# Altium schematic sheet HeaderC.SchDoc: 02290_Sonoma_Controller
size B; ApprovedBy: J Johnson; CheckedBy: J Johnson; Author: sdfasdfdfAEFfasdFfaF; DrawnBy: J Johnson; Organization: Opsero Electronic Design; Address1: 21-915 Av. Marguerite-Bourgeoys; Address2: Québec (QC); Address3: G1S 3X4; DocumentNumber: OP009-001-SCH; Revision: B-1; SheetNumber: 11; SheetTotal: 16; Tel1: (581) 308-8830; Tel2: (581) 308-8830; Project: 02290_Sonoma_Controller; CheckedDate: yyyy-mm-dd; Sheet: Header C; PageSetup: Record=PageOptions|CenterHorizontal=True|CenterVertical=True|PrintScale=1.08|XCorrection=1.00|YCorrection=1.00|PrintKind=0|BorderSize=5000000|LeftOffset=0|BottomOffset=0|Orientation=2|PaperLength=1000|PaperWidth=1000|Scale=100|PaperSource=7|PrintQuality=-4|MediaType=1|DitherType=10|PaperKind=Tabloid     [11 x 17 in]|PrintScaleMode=1; DrawDate: 2013-12-13; SchTitle: 02290_Sonoma_Controller; RevDescription: Removed QSPI, JP4/5, temp mon, JP6, U31; RevDate: 2019-05-24; RevBy: J Johnson; RevDescription2: Replaced D1 with RB521S30, J2 with L834-1G1T-S7; RevDescription3: Replaced FETs with TSM900N06CW RPG
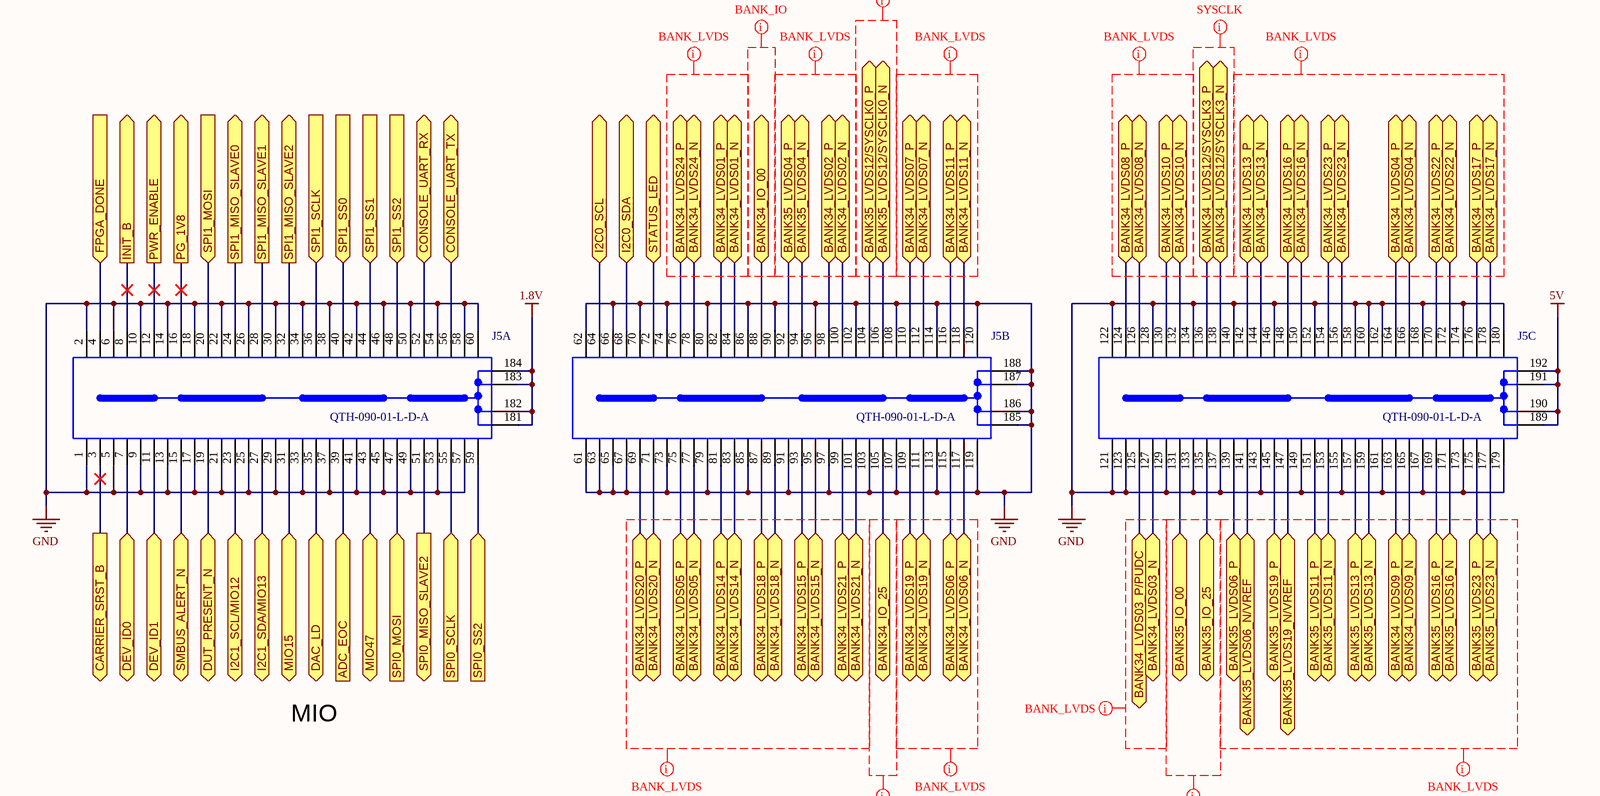
[diagram p0: HeaderC.SchDoc]

## Parts
J5  QTH-090-01-L-D-A  [QTH-090-01-L-D-A]  (parts A,B,C of 3)

## Ports
ADC_EOC (in), BANK34_IO_00 (bidir), BANK34_IO_25 (bidir), BANK34_LVDS01_N (bidir), BANK34_LVDS01_P (bidir), BANK34_LVDS02_N (bidir), BANK34_LVDS02_P (bidir), BANK34_LVDS03_N (bidir), BANK34_LVDS03_P/PUDC (bidir), BANK34_LVDS04_N (bidir), BANK34_LVDS04_P (bidir), BANK34_LVDS05_N (bidir), BANK34_LVDS05_P (bidir), BANK34_LVDS06_N (bidir), BANK34_LVDS06_P (bidir), BANK34_LVDS07_N (bidir), BANK34_LVDS07_P (bidir), BANK34_LVDS08_N (bidir), BANK34_LVDS08_P (bidir), BANK34_LVDS09_N (bidir), BANK34_LVDS09_P (bidir), BANK34_LVDS10_N (bidir), BANK34_LVDS10_P (bidir), BANK34_LVDS11_N (bidir), BANK34_LVDS11_P (bidir), BANK34_LVDS12/SYSCLK3_N (bidir), BANK34_LVDS12/SYSCLK3_P (bidir), BANK34_LVDS13_N (bidir), BANK34_LVDS13_P (bidir), BANK34_LVDS14_N (bidir), BANK34_LVDS14_P (bidir), BANK34_LVDS15_N (bidir), BANK34_LVDS15_P (bidir), BANK34_LVDS16_N (bidir), BANK34_LVDS16_P (bidir), BANK34_LVDS17_N (bidir), BANK34_LVDS17_P (bidir), BANK34_LVDS18_N (bidir), BANK34_LVDS18_P (bidir), BANK34_LVDS19_N (bidir), BANK34_LVDS19_P (bidir), BANK34_LVDS20_N (bidir), BANK34_LVDS20_P (bidir), BANK34_LVDS21_N (bidir), BANK34_LVDS21_P (bidir), BANK34_LVDS22_N (bidir), BANK34_LVDS22_P (bidir), BANK34_LVDS23_N (bidir), BANK34_LVDS23_P (bidir), BANK34_LVDS24_N (bidir), BANK34_LVDS24_P (bidir), BANK35_IO_00 (bidir), BANK35_IO_25 (bidir), BANK35_LVDS04_N (bidir), BANK35_LVDS04_P (bidir), BANK35_LVDS06_N/VREF (bidir), BANK35_LVDS06_P (bidir), BANK35_LVDS11_N (bidir), BANK35_LVDS11_P (bidir), BANK35_LVDS12/SYSCLK0_N (bidir), BANK35_LVDS12/SYSCLK0_P (bidir), BANK35_LVDS13_N (bidir), BANK35_LVDS13_P (bidir), BANK35_LVDS16_N (bidir), BANK35_LVDS16_P (bidir), BANK35_LVDS19_N/VREF (bidir), BANK35_LVDS19_P (bidir), BANK35_LVDS23_N (bidir), BANK35_LVDS23_P (bidir), CARRIER_SRST_B (out), CONSOLE_UART_RX (bidir), CONSOLE_UART_TX (bidir), DAC_LD (bidir), DEV_ID0 (bidir), DEV_ID1 (bidir), DUT_PRESENT_N (bidir), FPGA_DONE (in), I2C0_SCL (bidir), I2C0_SDA (bidir), I2C1_SCL/MIO12 (bidir), I2C1_SDA/MIO13 (bidir), INIT_B (out), MIO15 (bidir), MIO47 (bidir), PG_1V8 (out), PWR_ENABLE (out), SMBUS_ALERT_N (bidir), SPI0_MISO_SLAVE2 (out), SPI0_MOSI (in), SPI0_SCLK (in), SPI0_SS2 (in), SPI1_MISO_SLAVE0 (out), SPI1_MISO_SLAVE1 (out), SPI1_MISO_SLAVE2 (out), SPI1_MOSI (in), SPI1_SCLK (in), SPI1_SS0 (in), SPI1_SS1 (in), SPI1_SS2 (in), STATUS_LED (bidir)

## Nets
1.8V: J5.181 J5.182 J5.183 J5.184
5V: J5.189 J5.190 J5.191 J5.192
GND: J5.1 J5.2 J5.5 J5.6 J5.9 J5.10 J5.13 J5.14 J5.17 J5.18 J5.21 J5.22 J5.25 J5.26 J5.29 J5.30 J5.33 J5.34 J5.37 J5.38 J5.41 J5.42 J5.45 J5.46 J5.49 J5.50 J5.53 J5.54 J5.57 J5.58 J5.60 J5.61 J5.62 J5.63 J5.65 J5.66 J5.67 J5.70 J5.73 J5.74 J5.79 J5.80 J5.85 J5.86 J5.90 J5.91 J5.96 J5.97 J5.102 J5.103 J5.107 J5.108 J5.113 J5.114 J5.119 J5.120 J5.121 J5.122 J5.123 J5.128 J5.129 J5.133 J5.134 J5.137 J5.140 J5.143 J5.146 J5.149 J5.152 J5.155 J5.158 J5.160 J5.161 J5.162 J5.167 J5.168 J5.173 J5.174 J5.179 J5.180 J5.185 J5.186 J5.187 J5.188
ADC_EOC: J5.39 ; port ADC_EOC
BANK34_IO_00: J5.88 ; port BANK34_IO_00
BANK34_IO_25: J5.105 ; port BANK34_IO_25
BANK34_LVDS01_N: J5.84 ; port BANK34_LVDS01_N
BANK34_LVDS01_P: J5.82 ; port BANK34_LVDS01_P
BANK34_LVDS02_N: J5.100 ; port BANK34_LVDS02_N
BANK34_LVDS02_P: J5.98 ; port BANK34_LVDS02_P
BANK34_LVDS03_N: J5.127 ; port BANK34_LVDS03_N
BANK34_LVDS03_P/PUDC: J5.125 ; port BANK34_LVDS03_P/PUDC
BANK34_LVDS04_N: J5.166 ; port BANK34_LVDS04_N
BANK34_LVDS04_P: J5.164 ; port BANK34_LVDS04_P
BANK34_LVDS05_N: J5.77 ; port BANK34_LVDS05_N
BANK34_LVDS05_P: J5.75 ; port BANK34_LVDS05_P
BANK34_LVDS06_N: J5.117 ; port BANK34_LVDS06_N
BANK34_LVDS06_P: J5.115 ; port BANK34_LVDS06_P
BANK34_LVDS07_N: J5.112 ; port BANK34_LVDS07_N
BANK34_LVDS07_P: J5.110 ; port BANK34_LVDS07_P
BANK34_LVDS08_N: J5.126 ; port BANK34_LVDS08_N
BANK34_LVDS08_P: J5.124 ; port BANK34_LVDS08_P
BANK34_LVDS09_N: J5.165 ; port BANK34_LVDS09_N
BANK34_LVDS09_P: J5.163 ; port BANK34_LVDS09_P
BANK34_LVDS10_N: J5.132 ; port BANK34_LVDS10_N
BANK34_LVDS10_P: J5.130 ; port BANK34_LVDS10_P
BANK34_LVDS11_N: J5.118 ; port BANK34_LVDS11_N
BANK34_LVDS11_P: J5.116 ; port BANK34_LVDS11_P
BANK34_LVDS12/SYSCLK3_N: J5.138 ; port BANK34_LVDS12/SYSCLK3_N
BANK34_LVDS12/SYSCLK3_P: J5.136 ; port BANK34_LVDS12/SYSCLK3_P
BANK34_LVDS13_N: J5.144 ; port BANK34_LVDS13_N
BANK34_LVDS13_P: J5.142 ; port BANK34_LVDS13_P
BANK34_LVDS14_N: J5.83 ; port BANK34_LVDS14_N
BANK34_LVDS14_P: J5.81 ; port BANK34_LVDS14_P
BANK34_LVDS15_N: J5.95 ; port BANK34_LVDS15_N
BANK34_LVDS15_P: J5.93 ; port BANK34_LVDS15_P
BANK34_LVDS16_N: J5.150 ; port BANK34_LVDS16_N
BANK34_LVDS16_P: J5.148 ; port BANK34_LVDS16_P
BANK34_LVDS17_N: J5.178 ; port BANK34_LVDS17_N
BANK34_LVDS17_P: J5.176 ; port BANK34_LVDS17_P
BANK34_LVDS18_N: J5.89 ; port BANK34_LVDS18_N
BANK34_LVDS18_P: J5.87 ; port BANK34_LVDS18_P
BANK34_LVDS19_N: J5.111 ; port BANK34_LVDS19_N
BANK34_LVDS19_P: J5.109 ; port BANK34_LVDS19_P
BANK34_LVDS20_N: J5.71 ; port BANK34_LVDS20_N
BANK34_LVDS20_P: J5.69 ; port BANK34_LVDS20_P
BANK34_LVDS21_N: J5.101 ; port BANK34_LVDS21_N
BANK34_LVDS21_P: J5.99 ; port BANK34_LVDS21_P
BANK34_LVDS22_N: J5.172 ; port BANK34_LVDS22_N
BANK34_LVDS22_P: J5.170 ; port BANK34_LVDS22_P
BANK34_LVDS23_N: J5.156 ; port BANK34_LVDS23_N
BANK34_LVDS23_P: J5.154 ; port BANK34_LVDS23_P
BANK34_LVDS24_N: J5.78 ; port BANK34_LVDS24_N
BANK34_LVDS24_P: J5.76 ; port BANK34_LVDS24_P
BANK35_IO_00: J5.131 ; port BANK35_IO_00
BANK35_IO_25: J5.135 ; port BANK35_IO_25
BANK35_LVDS04_N: J5.94 ; port BANK35_LVDS04_N
BANK35_LVDS04_P: J5.92 ; port BANK35_LVDS04_P
BANK35_LVDS06_N/VREF: J5.141 ; port BANK35_LVDS06_N/VREF
BANK35_LVDS06_P: J5.139 ; port BANK35_LVDS06_P
BANK35_LVDS11_N: J5.153 ; port BANK35_LVDS11_N
BANK35_LVDS11_P: J5.151 ; port BANK35_LVDS11_P
BANK35_LVDS12/SYSCLK0_N: J5.106 ; port BANK35_LVDS12/SYSCLK0_N
BANK35_LVDS12/SYSCLK0_P: J5.104 ; port BANK35_LVDS12/SYSCLK0_P
BANK35_LVDS13_N: J5.159 ; port BANK35_LVDS13_N
BANK35_LVDS13_P: J5.157 ; port BANK35_LVDS13_P
BANK35_LVDS16_N: J5.171 ; port BANK35_LVDS16_N
BANK35_LVDS16_P: J5.169 ; port BANK35_LVDS16_P
BANK35_LVDS19_N/VREF: J5.147 ; port BANK35_LVDS19_N/VREF
BANK35_LVDS19_P: J5.145 ; port BANK35_LVDS19_P
BANK35_LVDS23_N: J5.177 ; port BANK35_LVDS23_N
BANK35_LVDS23_P: J5.175 ; port BANK35_LVDS23_P
CARRIER_SRST_B: J5.3 ; port CARRIER_SRST_B
CONSOLE_UART_RX: J5.52 ; port CONSOLE_UART_RX
CONSOLE_UART_TX: J5.56 ; port CONSOLE_UART_TX
DAC_LD: J5.35 ; port DAC_LD
DEV_ID0: J5.7 ; port DEV_ID0
DEV_ID1: J5.11 ; port DEV_ID1
DUT_PRESENT_N: J5.19 ; port DUT_PRESENT_N
FPGA_DONE: J5.4 ; port FPGA_DONE
I2C0_SCL: J5.64 ; port I2C0_SCL
I2C0_SDA: J5.68 ; port I2C0_SDA
I2C1_SCL/MIO12: J5.23 ; port I2C1_SCL/MIO12
I2C1_SDA/MIO13: J5.27 ; port I2C1_SDA/MIO13
INIT_B: J5.8 ; port INIT_B
MIO15: J5.31 ; port MIO15
MIO47: J5.43 ; port MIO47
PG_1V8: J5.16 ; port PG_1V8
PWR_ENABLE: J5.12 ; port PWR_ENABLE
SMBUS_ALERT_N: J5.15 ; port SMBUS_ALERT_N
SPI0_MISO_SLAVE2: J5.51 ; port SPI0_MISO_SLAVE2
SPI0_MOSI: J5.47 ; port SPI0_MOSI
SPI0_SCLK: J5.55 ; port SPI0_SCLK
SPI0_SS2: J5.59 ; port SPI0_SS2
SPI1_MISO_SLAVE0: J5.24 ; port SPI1_MISO_SLAVE0
SPI1_MISO_SLAVE1: J5.28 ; port SPI1_MISO_SLAVE1
SPI1_MISO_SLAVE2: J5.32 ; port SPI1_MISO_SLAVE2
SPI1_MOSI: J5.20 ; port SPI1_MOSI
SPI1_SCLK: J5.36 ; port SPI1_SCLK
SPI1_SS0: J5.40 ; port SPI1_SS0
SPI1_SS1: J5.44 ; port SPI1_SS1
SPI1_SS2: J5.48 ; port SPI1_SS2
STATUS_LED: J5.72 ; port STATUS_LED

## Layout directives
net class BANK_LVDS: (no net found under the mark)
net class BANK_LVDS_SYSCLK: (no net found under the mark)
net class BANK_IO: (no net found under the mark)

## Notes on the sheet
- MIO
- REV.
- DESCRIPTION
- DATE
- APPROVED
- Incal Inc.
- SHEET
- TITLE
- CONFIG.
- PROJECT
- SIZE
- SCH P/N.
- DRAWN
- B
- OF

## Library data of the parts
J5 = QTH-090-01-L-D-A: Connector Header HS .5mm 180 pin DL AU; Manufacturer 1: Samtec; PART NUMBER: QTH-090-01-L-D-A; Part Ref: QTH-090-01-L-D-A; RoHs: True; Value: QTH-090-01-L-D-A; Mfg Part Number 1: QTH-090-01-L-D-A